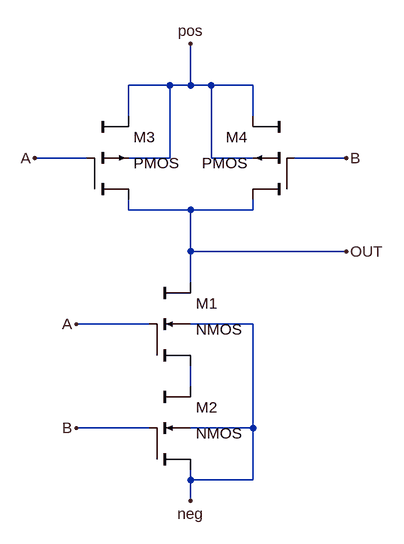
[diagram p0: schematic NAND.asc]
NAND.asc, the LTspice schematic file:
Version 4
SHEET 1 880 700
WIRE 96 -112 32 -112
WIRE 128 -112 128 -176
WIRE 128 -112 96 -112
WIRE 160 -112 128 -112
WIRE 224 -112 160 -112
WIRE 32 -64 32 -112
WIRE 224 -64 224 -112
WIRE -32 0 -112 0
WIRE 96 0 96 -112
WIRE 96 0 32 0
WIRE 160 0 160 -112
WIRE 224 0 160 0
WIRE 368 0 288 0
WIRE 32 80 32 64
WIRE 128 80 32 80
WIRE 224 80 224 64
WIRE 224 80 128 80
WIRE 128 144 128 80
WIRE 368 144 128 144
WIRE 128 192 128 144
WIRE 64 256 -48 256
WIRE 224 256 128 256
WIRE 128 352 128 320
WIRE 64 416 -48 416
WIRE 224 416 224 256
WIRE 224 416 128 416
WIRE 128 496 128 480
WIRE 224 496 224 416
WIRE 224 496 128 496
WIRE 128 528 128 496
FLAG -112 0 A
FLAG 368 0 B
FLAG -48 256 A
FLAG -48 416 B
FLAG 368 144 OUT
FLAG 128 -176 pos
FLAG 128 528 neg
SYMBOL cktsym\\nmos4 128 256 R0
SYMATTR InstName M1
SYMATTR Value2 l=nmosL w=nmosW
SYMBOL cktsym\\nmos4 128 416 R0
SYMATTR InstName M2
SYMATTR Value2 l=nmosL w=nmosW
SYMBOL cktsym\\pmos4 32 0 R0
SYMATTR InstName M3
SYMATTR Value2 l=pmosL w=pmosW
SYMBOL cktsym\\pmos4 224 0 M0
SYMATTR InstName M4
SYMATTR Value2 l=pmosL w=pmosW

The netlist it stands for:
* NAND.asc
M1 OUT A N001 neg NMOS l=nmosL w=nmosW
M2 N001 B neg neg NMOS l=nmosL w=nmosW
M3 OUT A pos pos PMOS l=pmosL w=pmosW
M4 OUT B pos pos PMOS l=pmosL w=pmosW
.model NMOS NMOS
.model PMOS PMOS
.lib standard.mos
.backanno
.end